# Altium schematic sheet Ldo.+6V5.+5V0.SchDoc
size A4
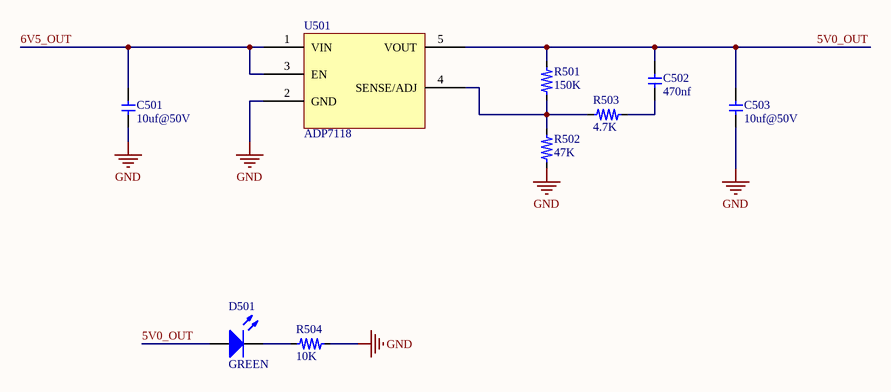
[diagram p0: Ldo.+6V5.+5V0.SchDoc]

## Parts
C501  value 10uf@50V  [C1210]  (hidden comment: Cap)
C502  value 470nf  [C0603]  (hidden comment: Cap)
C503  value 10uf@50V  [C1210]  (hidden comment: Cap)
D501  value GREEN  [LED0603]  (hidden comment: LED)
R501  value 150K  [R0603]  (hidden comment: Res)
R502  value 47K  [R0603]  (hidden comment: Res)
R503  value 4.7K  [R0603]  (hidden comment: Res)
R504  value 10K  [R0603]  (hidden comment: Res)
U501  ADP7118  [ADP7118-TSOT5]

## Nets
GND: C501.1 C503.1 R502.1 R504.1 U501.2(GND)
5V0_OUT: C502.1 C503.2 D501.1(A) R501.2 U501.5(VOUT)
6V5_OUT: C501.2 U501.1(VIN) U501.3(EN)
NetC502_2: C502.2 R503.1
NetD501_2: D501.2(K) R504.2
NetR501_1: R501.1 R502.2 R503.2 U501.4(SENSE/ADJ)

## Library data of the parts
R501-R504 = Res: 电阻
U501 = ADP7118AUJ: 20 V, 200 mA, Low Noise,CMOS LDO Linear Regulator.